# Altium schematic sheet Business_Card.SchDoc: OLC_O6G_REVA
size A; ApprovedBy: Emmanuel Plascencia; CheckedBy: Emmanuel Plascencia; DocumentNumber: 1; SheetNumber: 1; SheetTotal: 3; Size: A
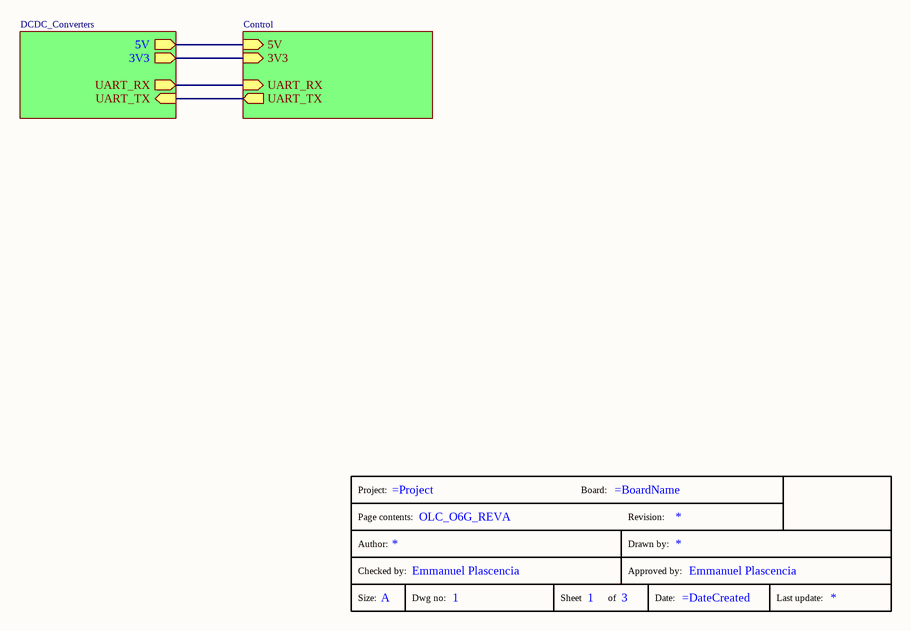
[diagram p0: Business_Card.SchDoc]

## Parts
U?  Title Block  (value not drawn)  (graphical)

## Sub-sheets
U_DCDC_Converters = DCDC_Converters: 5V (out), UART_RX (out), UART_TX (in), 3V3 (out)
U_OLC_Control = Control: 5V (in), UART_RX (in), UART_TX (out), 3V3 (in)

## Nets
(unnamed): sheet U_OLC_Control/5V, sheet U_DCDC_Converters/5V
(unnamed): sheet U_OLC_Control/UART_RX, sheet U_DCDC_Converters/UART_RX
(unnamed): sheet U_OLC_Control/UART_TX, sheet U_DCDC_Converters/UART_TX
(unnamed): sheet U_OLC_Control/3V3, sheet U_DCDC_Converters/3V3

## Notes on the sheet
- (in symbol Title Blok OLEDCOMM) Project:; Board:; Page contents:; Revision:; Author:; Drawn by:; Checked by:; Approved by:; Size:; Dwg no:; Sheet; of; Date:; Last update:

## Library data of the parts
U? = Title Blok OLEDCOMM